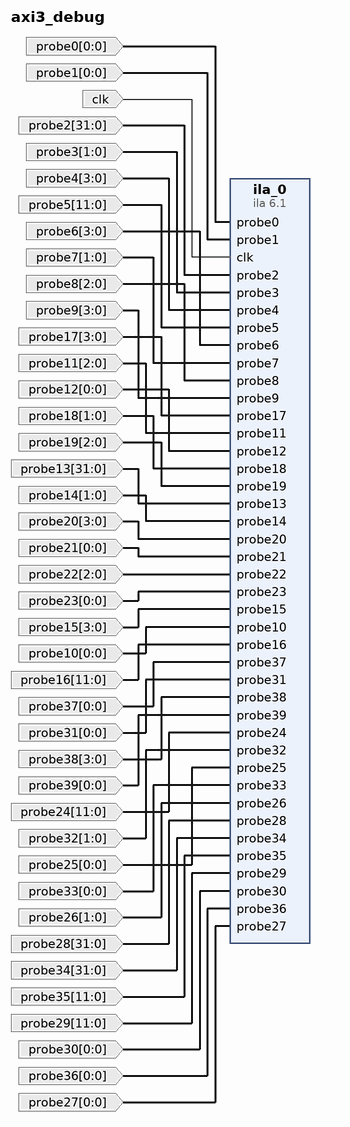
[diagram p0: block diagram of the top level]
# Vivado block design axi3_debug, Vivado 2016.1
create_bd_design axi3_debug

create_bd_port -dir I -from 0 -to 0 probe0
create_bd_port -dir I -from 0 -to 0 probe1
create_bd_port -dir I -type clk clk
create_bd_port -dir I -from 31 -to 0 probe2
create_bd_port -dir I -from 1 -to 0 probe3
create_bd_port -dir I -from 3 -to 0 probe4
create_bd_port -dir I -from 11 -to 0 probe5
create_bd_port -dir I -from 3 -to 0 probe6
create_bd_port -dir I -from 1 -to 0 probe7
create_bd_port -dir I -from 2 -to 0 probe8
create_bd_port -dir I -from 3 -to 0 probe9
create_bd_port -dir I -from 3 -to 0 probe17
create_bd_port -dir I -from 2 -to 0 probe11
create_bd_port -dir I -from 0 -to 0 probe12
create_bd_port -dir I -from 1 -to 0 probe18
create_bd_port -dir I -from 2 -to 0 probe19
create_bd_port -dir I -from 31 -to 0 probe13
create_bd_port -dir I -from 1 -to 0 probe14
create_bd_port -dir I -from 3 -to 0 probe20
create_bd_port -dir I -from 0 -to 0 probe21
create_bd_port -dir I -from 2 -to 0 probe22
create_bd_port -dir I -from 0 -to 0 probe23
create_bd_port -dir I -from 3 -to 0 probe15
create_bd_port -dir I -from 0 -to 0 probe10
create_bd_port -dir I -from 11 -to 0 probe16
create_bd_port -dir I -from 0 -to 0 probe37
create_bd_port -dir I -from 0 -to 0 probe31
create_bd_port -dir I -from 3 -to 0 probe38
create_bd_port -dir I -from 0 -to 0 probe39
create_bd_port -dir I -from 11 -to 0 probe24
create_bd_port -dir I -from 1 -to 0 probe32
create_bd_port -dir I -from 0 -to 0 probe25
create_bd_port -dir I -from 0 -to 0 probe33
create_bd_port -dir I -from 1 -to 0 probe26
create_bd_port -dir I -from 31 -to 0 probe28
create_bd_port -dir I -from 31 -to 0 probe34
create_bd_port -dir I -from 11 -to 0 probe35
create_bd_port -dir I -from 11 -to 0 probe29
create_bd_port -dir I -from 0 -to 0 probe30
create_bd_port -dir I -from 0 -to 0 probe36
create_bd_port -dir I -from 0 -to 0 probe27

create_bd_cell -type ip -vlnv xilinx.com:ip:ila:6.1 ila_0
set_property -dict [list \
  CONFIG.C_PROBE38_WIDTH 4 \
  CONFIG.C_PROBE35_WIDTH 12 \
  CONFIG.C_PROBE34_WIDTH 32 \
  CONFIG.C_PROBE32_WIDTH 2 \
  CONFIG.C_PROBE29_WIDTH 12 \
  CONFIG.C_PROBE28_WIDTH 32 \
  CONFIG.C_PROBE26_WIDTH 2 \
  CONFIG.C_PROBE24_WIDTH 12 \
  CONFIG.C_PROBE22_WIDTH 3 \
  CONFIG.C_PROBE20_WIDTH 4 \
  CONFIG.C_PROBE19_WIDTH 3 \
  CONFIG.C_PROBE18_WIDTH 2 \
  CONFIG.C_PROBE17_WIDTH 4 \
  CONFIG.C_PROBE16_WIDTH 12 \
  CONFIG.C_PROBE15_WIDTH 4 \
  CONFIG.C_PROBE14_WIDTH 2 \
  CONFIG.C_PROBE13_WIDTH 32 \
  CONFIG.C_PROBE11_WIDTH 3 \
  CONFIG.C_PROBE9_WIDTH 4 \
  CONFIG.C_PROBE8_WIDTH 3 \
  CONFIG.C_PROBE7_WIDTH 2 \
  CONFIG.C_PROBE6_WIDTH 4 \
  CONFIG.C_PROBE5_WIDTH 12 \
  CONFIG.C_PROBE4_WIDTH 4 \
  CONFIG.C_PROBE3_WIDTH 2 \
  CONFIG.C_PROBE2_WIDTH 32 \
  CONFIG.C_DATA_DEPTH 2048 \
  CONFIG.C_NUM_OF_PROBES 40 \
  CONFIG.C_TRIGOUT_EN false \
  CONFIG.C_EN_STRG_QUAL 1 \
  CONFIG.C_INPUT_PIPE_STAGES 1 \
  CONFIG.C_ADV_TRIGGER true \
  CONFIG.C_PROBE39_MU_CNT 2 \
  CONFIG.C_PROBE38_MU_CNT 2 \
  CONFIG.C_PROBE37_MU_CNT 2 \
  CONFIG.C_PROBE36_MU_CNT 2 \
  CONFIG.C_PROBE35_MU_CNT 2 \
  CONFIG.C_PROBE34_MU_CNT 2 \
  CONFIG.C_PROBE33_MU_CNT 2 \
  CONFIG.C_PROBE32_MU_CNT 2 \
  CONFIG.C_PROBE31_MU_CNT 2 \
  CONFIG.C_PROBE30_MU_CNT 2 \
  CONFIG.C_PROBE29_MU_CNT 2 \
  CONFIG.C_PROBE28_MU_CNT 2 \
  CONFIG.C_PROBE27_MU_CNT 2 \
  CONFIG.C_PROBE26_MU_CNT 2 \
  CONFIG.C_PROBE25_MU_CNT 2 \
  CONFIG.C_PROBE24_MU_CNT 2 \
  CONFIG.C_PROBE23_MU_CNT 2 \
  CONFIG.C_PROBE22_MU_CNT 2 \
  CONFIG.C_PROBE21_MU_CNT 2 \
  CONFIG.C_PROBE20_MU_CNT 2 \
  CONFIG.C_PROBE19_MU_CNT 2 \
  CONFIG.C_PROBE18_MU_CNT 2 \
  CONFIG.C_PROBE17_MU_CNT 2 \
  CONFIG.C_PROBE16_MU_CNT 2 \
  CONFIG.C_PROBE15_MU_CNT 2 \
  CONFIG.C_PROBE14_MU_CNT 2 \
  CONFIG.C_PROBE13_MU_CNT 2 \
  CONFIG.C_PROBE12_MU_CNT 2 \
  CONFIG.C_PROBE11_MU_CNT 2 \
  CONFIG.C_PROBE10_MU_CNT 2 \
  CONFIG.C_PROBE9_MU_CNT 2 \
  CONFIG.C_PROBE8_MU_CNT 2 \
  CONFIG.C_PROBE7_MU_CNT 2 \
  CONFIG.C_PROBE6_MU_CNT 2 \
  CONFIG.C_PROBE5_MU_CNT 2 \
  CONFIG.C_PROBE4_MU_CNT 2 \
  CONFIG.C_PROBE3_MU_CNT 2 \
  CONFIG.C_PROBE2_MU_CNT 2 \
  CONFIG.C_PROBE1_MU_CNT 2 \
  CONFIG.C_PROBE0_MU_CNT 2 \
  CONFIG.ALL_PROBE_SAME_MU_CNT 2 \
  CONFIG.C_ENABLE_ILA_AXI_MON false \
  CONFIG.C_MONITOR_TYPE Native \
] [get_bd_cells ila_0]

# ---- connections ----

connect_bd_net -net probe0_1 [get_bd_ports probe0] [get_bd_pins ila_0/probe0]
connect_bd_net -net probe1_1 [get_bd_ports probe1] [get_bd_pins ila_0/probe1]
connect_bd_net [get_bd_ports clk] [get_bd_pins ila_0/clk]
connect_bd_net -net probe2_1 [get_bd_ports probe2] [get_bd_pins ila_0/probe2]
connect_bd_net -net probe3_1 [get_bd_ports probe3] [get_bd_pins ila_0/probe3]
connect_bd_net -net probe4_1 [get_bd_ports probe4] [get_bd_pins ila_0/probe4]
connect_bd_net -net probe5_1 [get_bd_ports probe5] [get_bd_pins ila_0/probe5]
connect_bd_net -net probe6_1 [get_bd_ports probe6] [get_bd_pins ila_0/probe6]
connect_bd_net -net probe7_1 [get_bd_ports probe7] [get_bd_pins ila_0/probe7]
connect_bd_net -net probe8_1 [get_bd_ports probe8] [get_bd_pins ila_0/probe8]
connect_bd_net -net probe9_1 [get_bd_ports probe9] [get_bd_pins ila_0/probe9]
connect_bd_net -net probe17_1 [get_bd_ports probe17] [get_bd_pins ila_0/probe17]
connect_bd_net -net probe11_1 [get_bd_ports probe11] [get_bd_pins ila_0/probe11]
connect_bd_net -net probe12_1 [get_bd_ports probe12] [get_bd_pins ila_0/probe12]
connect_bd_net -net probe18_1 [get_bd_ports probe18] [get_bd_pins ila_0/probe18]
connect_bd_net -net probe19_1 [get_bd_ports probe19] [get_bd_pins ila_0/probe19]
connect_bd_net -net probe13_1 [get_bd_ports probe13] [get_bd_pins ila_0/probe13]
connect_bd_net -net probe14_1 [get_bd_ports probe14] [get_bd_pins ila_0/probe14]
connect_bd_net -net probe20_1 [get_bd_ports probe20] [get_bd_pins ila_0/probe20]
connect_bd_net -net probe21_1 [get_bd_ports probe21] [get_bd_pins ila_0/probe21]
connect_bd_net -net probe22_1 [get_bd_ports probe22] [get_bd_pins ila_0/probe22]
connect_bd_net -net probe23_1 [get_bd_ports probe23] [get_bd_pins ila_0/probe23]
connect_bd_net -net probe15_1 [get_bd_ports probe15] [get_bd_pins ila_0/probe15]
connect_bd_net -net probe10_1 [get_bd_ports probe10] [get_bd_pins ila_0/probe10]
connect_bd_net -net probe16_1 [get_bd_ports probe16] [get_bd_pins ila_0/probe16]
connect_bd_net -net probe37_1 [get_bd_ports probe37] [get_bd_pins ila_0/probe37]
connect_bd_net -net probe31_1 [get_bd_ports probe31] [get_bd_pins ila_0/probe31]
connect_bd_net -net probe38_1 [get_bd_ports probe38] [get_bd_pins ila_0/probe38]
connect_bd_net -net probe39_1 [get_bd_ports probe39] [get_bd_pins ila_0/probe39]
connect_bd_net -net probe24_1 [get_bd_ports probe24] [get_bd_pins ila_0/probe24]
connect_bd_net -net probe32_1 [get_bd_ports probe32] [get_bd_pins ila_0/probe32]
connect_bd_net -net probe25_1 [get_bd_ports probe25] [get_bd_pins ila_0/probe25]
connect_bd_net -net probe33_1 [get_bd_ports probe33] [get_bd_pins ila_0/probe33]
connect_bd_net -net probe26_1 [get_bd_ports probe26] [get_bd_pins ila_0/probe26]
connect_bd_net -net probe28_1 [get_bd_ports probe28] [get_bd_pins ila_0/probe28]
connect_bd_net -net probe34_1 [get_bd_ports probe34] [get_bd_pins ila_0/probe34]
connect_bd_net -net probe35_1 [get_bd_ports probe35] [get_bd_pins ila_0/probe35]
connect_bd_net -net probe29_1 [get_bd_ports probe29] [get_bd_pins ila_0/probe29]
connect_bd_net -net probe30_1 [get_bd_ports probe30] [get_bd_pins ila_0/probe30]
connect_bd_net -net probe36_1 [get_bd_ports probe36] [get_bd_pins ila_0/probe36]
connect_bd_net -net probe27_1 [get_bd_ports probe27] [get_bd_pins ila_0/probe27]

validate_bd_design
save_bd_design
